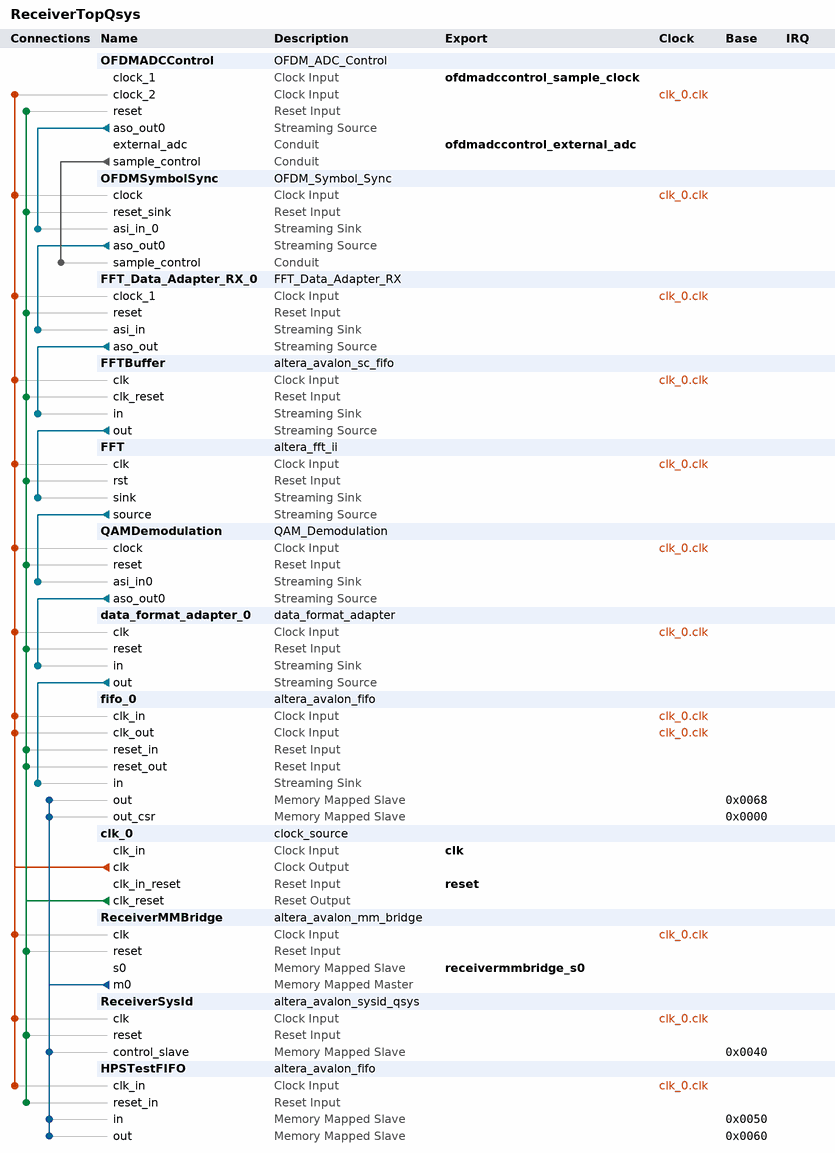
[diagram p0: system contents]
# Platform Designer (Qsys) system ReceiverTopQsys, Cyclone V 5CSXFC6D6F31C6
# Parameters at their usual value, and those the tool derives, are not listed.
package require -exact qsys 16.1
create_system ReceiverTopQsys
set_project_property DEVICE_FAMILY {Cyclone V}
set_project_property DEVICE 5CSXFC6D6F31C6

add_instance OFDMADCControl OFDM_ADC_Control 1.0

add_instance OFDMSymbolSync OFDM_Symbol_Sync 1.0

add_instance FFT_Data_Adapter_RX_0 FFT_Data_Adapter_RX 1.0
set_instance_parameter_value FFT_Data_Adapter_RX_0 EXTRA_LEFT_PADDING 0
set_instance_parameter_value FFT_Data_Adapter_RX_0 EXTRA_RIGHT_PADDING 0
set_instance_parameter_value FFT_Data_Adapter_RX_0 INPUT_SYMBOL_WIDTH 16
set_instance_parameter_value FFT_Data_Adapter_RX_0 INVERSE_FFT 0

add_instance FFTBuffer altera_avalon_sc_fifo 16.1
set_instance_parameter_value FFTBuffer BITS_PER_SYMBOL 33
set_instance_parameter_value FFTBuffer CHANNEL_WIDTH 0
set_instance_parameter_value FFTBuffer ERROR_WIDTH 0
set_instance_parameter_value FFTBuffer FIFO_DEPTH 2048
set_instance_parameter_value FFTBuffer USE_FILL_LEVEL 1
set_instance_parameter_value FFTBuffer USE_MEMORY_BLOCKS 1
set_instance_parameter_value FFTBuffer USE_PACKETS 1
set_instance_parameter_value FFTBuffer USE_STORE_FORWARD 1

add_instance FFT altera_fft_ii 16.1
set_instance_parameter_value FFT data_flow Streaming
set_instance_parameter_value FFT data_rep {Block Floating Point}
set_instance_parameter_value FFT engine_arch {Quad Output}
set_instance_parameter_value FFT in_width 16
set_instance_parameter_value FFT length 64
set_instance_parameter_value FFT out_order Natural
set_instance_parameter_value FFT out_width 29
set_instance_parameter_value FFT twid_width 16

add_instance QAMDemodulation QAM_Demodulation 1.0

add_instance data_format_adapter_0 data_format_adapter 16.1
set_instance_parameter_value data_format_adapter_0 inBitsPerSymbol 2
set_instance_parameter_value data_format_adapter_0 inChannelWidth 0
set_instance_parameter_value data_format_adapter_0 inErrorWidth 0
set_instance_parameter_value data_format_adapter_0 inMaxChannel 0
set_instance_parameter_value data_format_adapter_0 inReadyLatency 0
set_instance_parameter_value data_format_adapter_0 inSymbolsPerBeat 1
set_instance_parameter_value data_format_adapter_0 inUseEmpty false
set_instance_parameter_value data_format_adapter_0 inUseEmptyPort AUTO
set_instance_parameter_value data_format_adapter_0 inUsePackets false
set_instance_parameter_value data_format_adapter_0 outSymbolsPerBeat 16
set_instance_parameter_value data_format_adapter_0 outUseEmpty false
set_instance_parameter_value data_format_adapter_0 outUseEmptyPort AUTO

add_instance fifo_0 altera_avalon_fifo 16.1
set_instance_parameter_value fifo_0 bitsPerSymbol 2
set_instance_parameter_value fifo_0 channelWidth 0
set_instance_parameter_value fifo_0 errorWidth 0
set_instance_parameter_value fifo_0 fifoDepth 512
set_instance_parameter_value fifo_0 fifoInputInterfaceOptions AVALONST_SINK
set_instance_parameter_value fifo_0 fifoOutputInterfaceOptions AVALONMM_READ
set_instance_parameter_value fifo_0 singleClockMode false
set_instance_parameter_value fifo_0 symbolsPerBeat 16
set_instance_parameter_value fifo_0 useBackpressure false
set_instance_parameter_value fifo_0 useIRQ false
set_instance_parameter_value fifo_0 usePacket false
set_instance_parameter_value fifo_0 useReadControl true
set_instance_parameter_value fifo_0 useRegister true
set_instance_parameter_value fifo_0 useWriteControl false

add_instance clk_0 clock_source 16.1
set_instance_parameter_value clk_0 clockFrequency 100000000

add_instance ReceiverMMBridge altera_avalon_mm_bridge 16.1
set_instance_parameter_value ReceiverMMBridge ADDRESS_UNITS SYMBOLS
set_instance_parameter_value ReceiverMMBridge ADDRESS_WIDTH 10
set_instance_parameter_value ReceiverMMBridge DATA_WIDTH 32
set_instance_parameter_value ReceiverMMBridge MAX_PENDING_RESPONSES 4
set_instance_parameter_value ReceiverMMBridge USE_AUTO_ADDRESS_WIDTH 0

add_instance ReceiverSysId altera_avalon_sysid_qsys 16.1
set_instance_parameter_value ReceiverSysId id 591751049

add_instance HPSTestFIFO altera_avalon_fifo 16.1
set_instance_parameter_value HPSTestFIFO bitsPerSymbol 16
set_instance_parameter_value HPSTestFIFO channelWidth 8
set_instance_parameter_value HPSTestFIFO errorWidth 8
set_instance_parameter_value HPSTestFIFO fifoDepth 128
set_instance_parameter_value HPSTestFIFO fifoInputInterfaceOptions AVALONMM_WRITE
set_instance_parameter_value HPSTestFIFO fifoOutputInterfaceOptions AVALONMM_READ
set_instance_parameter_value HPSTestFIFO singleClockMode true
set_instance_parameter_value HPSTestFIFO symbolsPerBeat 2
set_instance_parameter_value HPSTestFIFO useIRQ true
set_instance_parameter_value HPSTestFIFO usePacket true
set_instance_parameter_value HPSTestFIFO useReadControl false
set_instance_parameter_value HPSTestFIFO useWriteControl false

# connections
add_connection clk_0.clk data_format_adapter_0.clk clock
add_connection clk_0.clk FFT.clk clock
add_connection clk_0.clk FFT_Data_Adapter_RX_0.clock_1 clock
add_connection clk_0.clk FFTBuffer.clk clock
add_connection clk_0.clk fifo_0.clk_in clock
add_connection clk_0.clk fifo_0.clk_out clock
add_connection clk_0.clk HPSTestFIFO.clk_in clock
add_connection clk_0.clk OFDMADCControl.clock_2 clock
add_connection clk_0.clk OFDMSymbolSync.clock clock
add_connection clk_0.clk QAMDemodulation.clock clock
add_connection clk_0.clk ReceiverMMBridge.clk clock
add_connection clk_0.clk ReceiverSysId.clk clock
add_connection clk_0.clk_reset data_format_adapter_0.reset reset
add_connection clk_0.clk_reset FFT.rst reset
add_connection clk_0.clk_reset FFT_Data_Adapter_RX_0.reset reset
add_connection clk_0.clk_reset FFTBuffer.clk_reset reset
add_connection clk_0.clk_reset fifo_0.reset_in reset
add_connection clk_0.clk_reset fifo_0.reset_out reset
add_connection clk_0.clk_reset HPSTestFIFO.reset_in reset
add_connection clk_0.clk_reset OFDMADCControl.reset reset
add_connection clk_0.clk_reset OFDMSymbolSync.reset_sink reset
add_connection clk_0.clk_reset QAMDemodulation.reset reset
add_connection clk_0.clk_reset ReceiverMMBridge.reset reset
add_connection clk_0.clk_reset ReceiverSysId.reset reset
add_connection ReceiverMMBridge.m0 fifo_0.out avalon
set_connection_parameter_value ReceiverMMBridge.m0/fifo_0.out baseAddress 0x0068
add_connection ReceiverMMBridge.m0 fifo_0.out_csr avalon
set_connection_parameter_value ReceiverMMBridge.m0/fifo_0.out_csr baseAddress 0x0000
add_connection ReceiverMMBridge.m0 HPSTestFIFO.in avalon
set_connection_parameter_value ReceiverMMBridge.m0/HPSTestFIFO.in baseAddress 0x0050
add_connection ReceiverMMBridge.m0 HPSTestFIFO.out avalon
set_connection_parameter_value ReceiverMMBridge.m0/HPSTestFIFO.out baseAddress 0x0060
add_connection ReceiverMMBridge.m0 ReceiverSysId.control_slave avalon
set_connection_parameter_value ReceiverMMBridge.m0/ReceiverSysId.control_slave baseAddress 0x0040
add_connection data_format_adapter_0.out fifo_0.in avalon_streaming
add_connection FFT.source QAMDemodulation.asi_in0 avalon_streaming
add_connection FFT_Data_Adapter_RX_0.aso_out FFTBuffer.in avalon_streaming
add_connection FFTBuffer.out FFT.sink avalon_streaming
add_connection OFDMADCControl.aso_out0 OFDMSymbolSync.asi_in_0 avalon_streaming
add_connection OFDMSymbolSync.aso_out0 FFT_Data_Adapter_RX_0.asi_in avalon_streaming
add_connection QAMDemodulation.aso_out0 data_format_adapter_0.in avalon_streaming
add_connection OFDMADCControl.sample_control OFDMSymbolSync.sample_control conduit

# exported interfaces
add_interface clk clock sink
set_interface_property clk EXPORT_OF clk_0.clk_in
add_interface ofdmadccontrol_external_adc conduit end
set_interface_property ofdmadccontrol_external_adc EXPORT_OF OFDMADCControl.external_adc
add_interface ofdmadccontrol_sample_clock clock sink
set_interface_property ofdmadccontrol_sample_clock EXPORT_OF OFDMADCControl.clock_1
add_interface receivermmbridge_s0 avalon slave
set_interface_property receivermmbridge_s0 EXPORT_OF ReceiverMMBridge.s0
add_interface reset reset sink
set_interface_property reset EXPORT_OF clk_0.clk_in_reset

set_interconnect_requirement {$system} qsys_mm.clockCrossingAdapter HANDSHAKE
set_interconnect_requirement {$system} qsys_mm.enableEccProtection FALSE
set_interconnect_requirement {$system} qsys_mm.insertDefaultSlave FALSE
set_interconnect_requirement {$system} qsys_mm.maxAdditionalLatency 1

save_system ReceiverTopQsys.qsys
